# Altium schematic sheet MainPlanSchDoc.SchDoc
size 420 x 297 mm; Date: 1404/07/05; CheckedBy: ?; DrawnBy: MohammadReza Tabasian; Engineer: MohammadReza Tabasian; SheetNumber: 1; SheetTotal: 2; SheetNumberSPQ: 1; SheetTotalSPQ: 2; Project: robotShield; FileName: MainPlanSchDoc.SchDoc
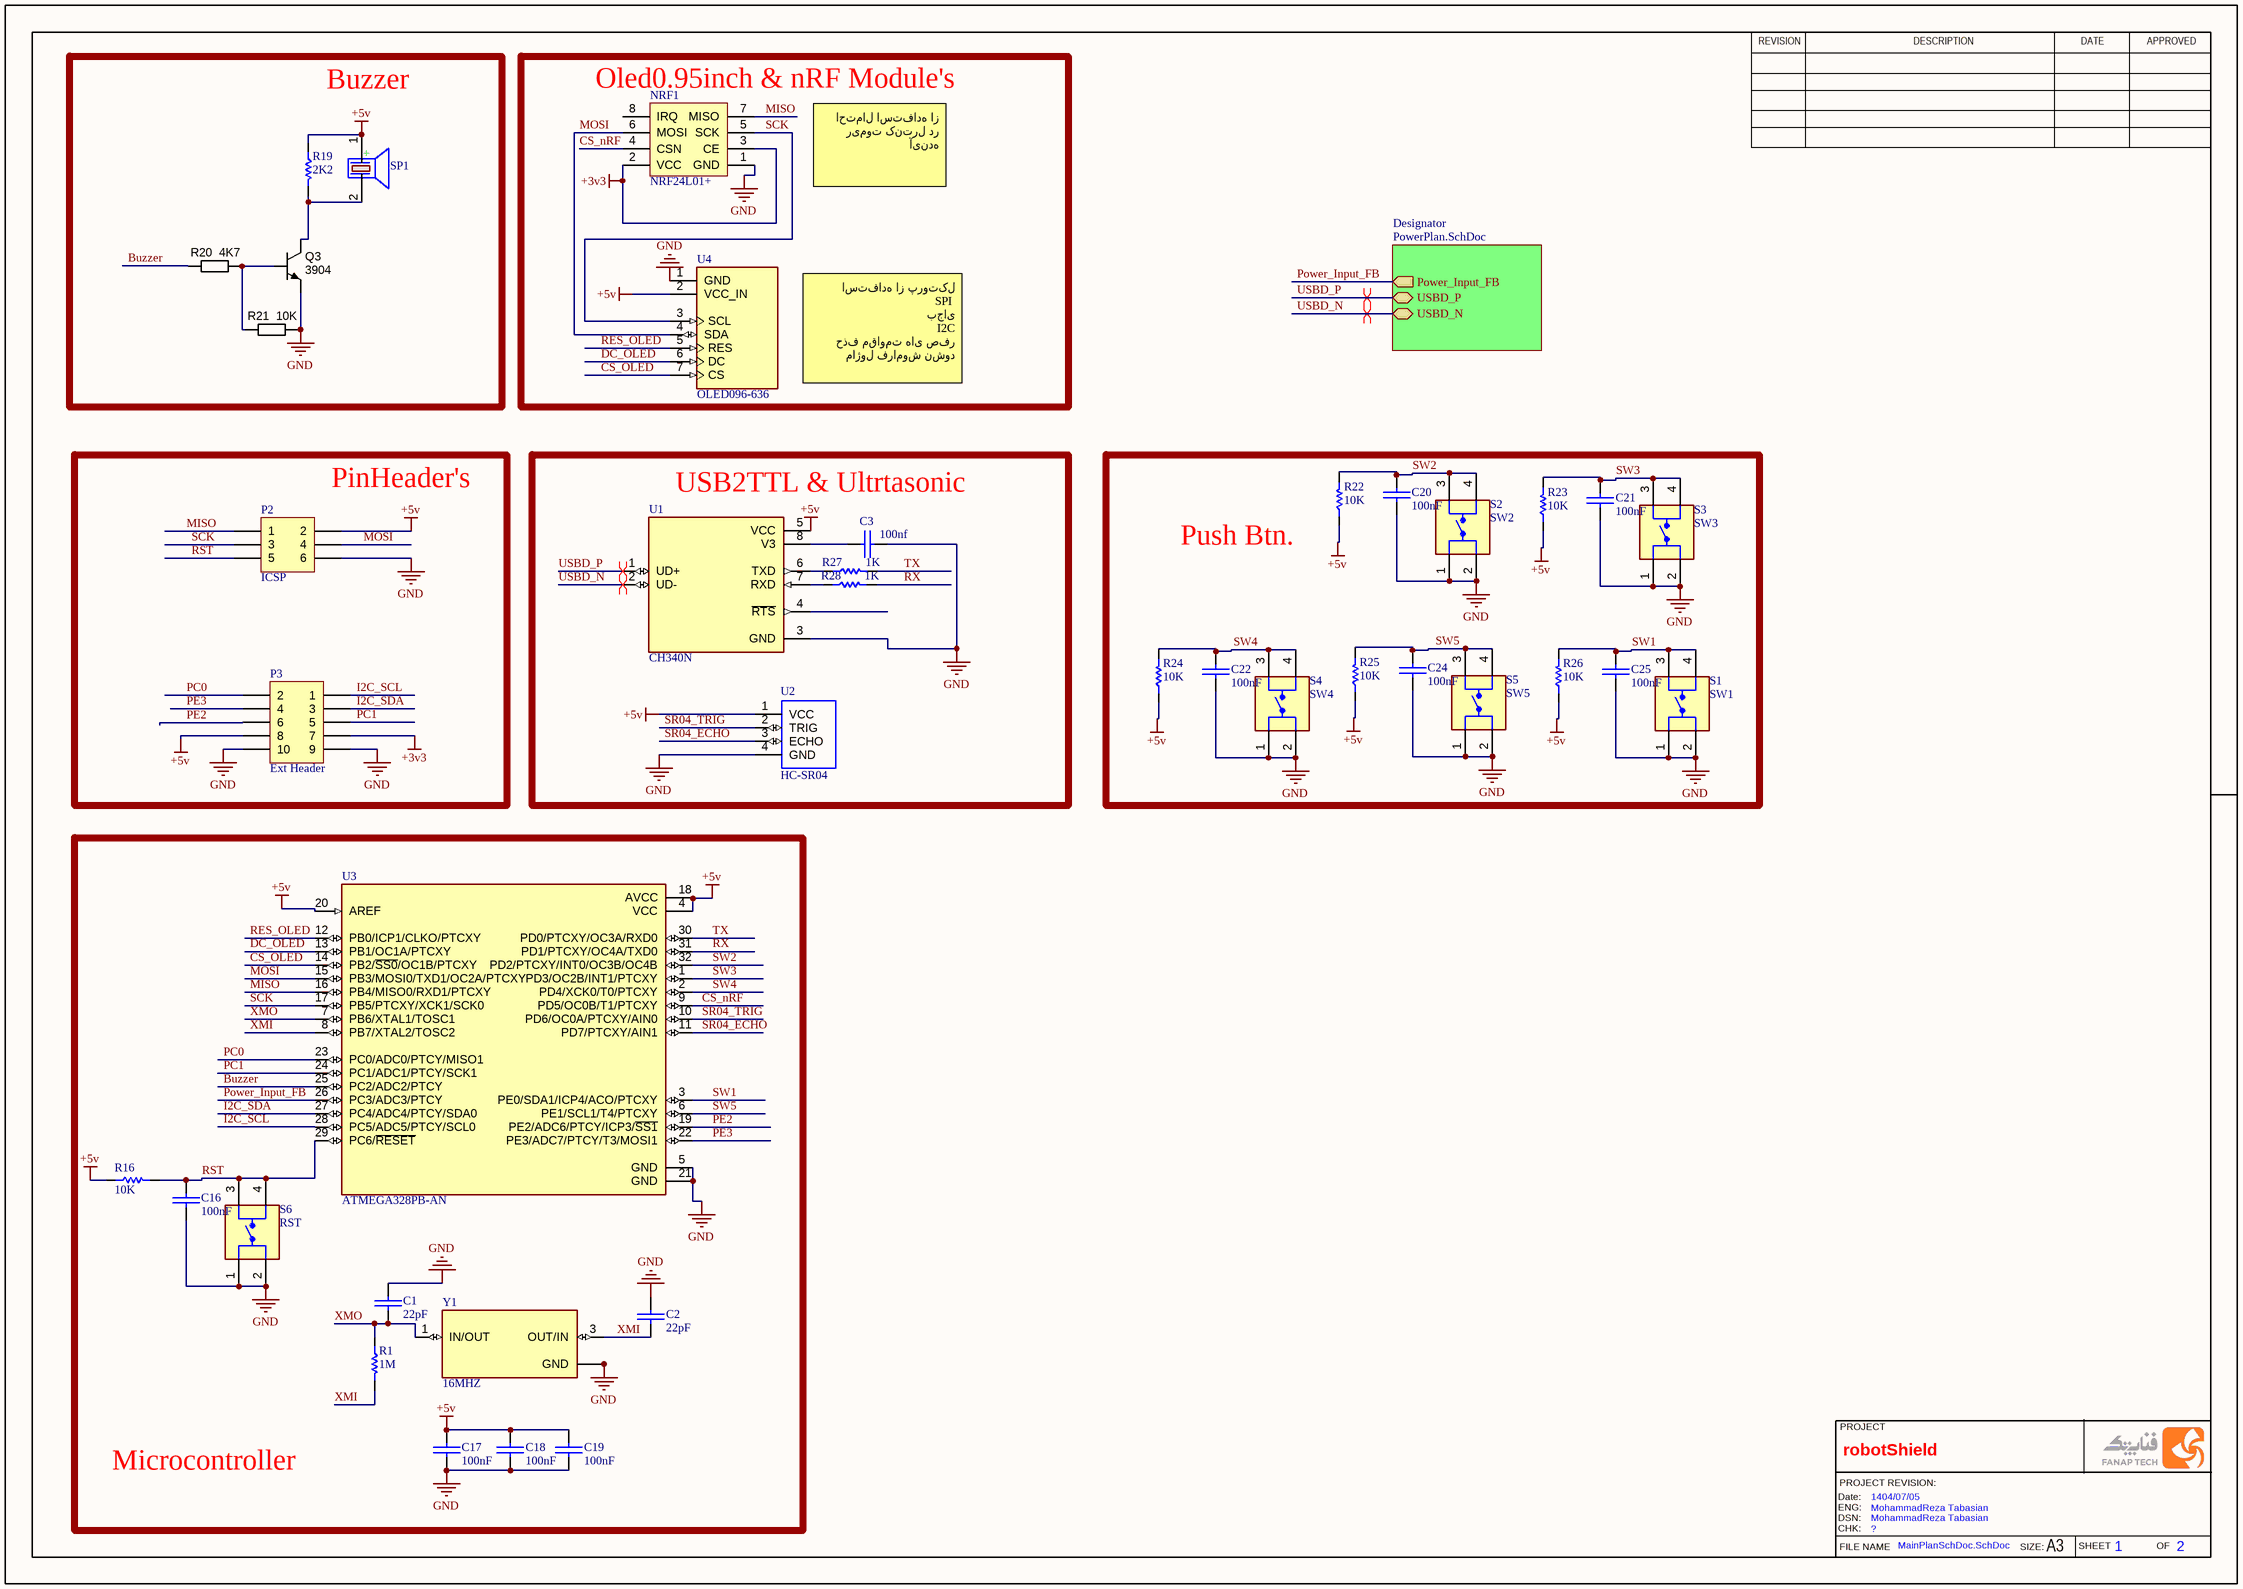
[diagram p0: MainPlanSchDoc.SchDoc]

## Parts
C1  22pF  [C0805]
C2  22pF  [C0805]
C3  100nf  [C0805]
C16  100nF  [C0805]
C17  100nF  [C0805]
C18  100nF  [C0805]
C19  100nF  [C0805]
C20  100nF  [C0805]
C21  100nF  [C0805]
C22  100nF  [C0805]
C24  100nF  [C0805]
C25  100nF  [C0805]
NRF1  NRF24L01+  [NRF24L01P]
P2  ICSP  [HDR2X3]
P3  Ext Header  [HDR2X5]
Q3  3904  [SOT23-3]
R1  1M  [C0805]
R16  10K  [C0805]
R19  2K2  [C0805]
R20  4K7  [C0805]
R21  10K  [C0805]
R22  10K  [C0805]
R23  10K  [C0805]
R24  10K  [C0805]
R25  10K  [C0805]
R26  10K  [C0805]
R27  1K  [C0805]
R28  1K  [C0805]
S1  SW1  [microswitch]
S2  SW2  [microswitch]
S3  SW3  [microswitch]
S4  SW4  [microswitch]
S5  SW5  [microswitch]
S6  RST  [microswitch]
SP1  (no value)  [BUZZER 7.62mm DC]
U1  CH340N  [SOIC_8P_127P600X170-9N]
U2  HC-SR04  [XCVR_HC-SR04]
U3  ATMEGA328PB-AN  [QFP80P900X900X160-32N]
U4  OLED096-636  [OLED096-636]
Y1  16MHZ  [XTAL_3225]

## Blocks framed on the sheet
Buzzer: Q3 R19-R21 SP1
Oled0.95inch & nRF Module's: NRF1 U4
PinHeader's: P2 P3
USB2TTL & Ultrtasonic: C3 R27 R28 U1 U2
Push Btn.: C20-C22 C24 C25 R22-R26 S1-S5
Microcontroller: C1 C2 C16-C19 R1 R16 S6 U3 Y1

## Sub-sheets
Designator = PowerPlan.SchDoc: Power_Input_FB (out), USBD_P (bidir), USBD_N (bidir)

## Nets
+3v3: NRF1.2(VCC) NRF1.3(CE) P3.7
+5v: C17.1(+) C18.1(+) C19.1(+) P2.2 P3.8 R16.1 R19.1 R22.1 R23.1 R24.1 R25.1 R26.1 SP1.1(+) U1.5(VCC) U2.1(VCC) U3.4(VCC) U3.18(AVCC) U3.20(AREF) U4.2(VCC_IN)
GND: C1.1(+) C2.1(+) C3.2(-) C16.2(-) C17.2(-) C18.2(-) C19.2(-) C20.2(-) C21.2(-) C22.2(-) C24.2(-) C25.2(-) NRF1.1(GND) P2.6 P3.9 P3.10 Q3.2(E) R21.2 S1.1 S1.2 S2.1 S2.2 S3.1 S3.2 S4.1 S4.2 S5.1 S5.2 S6.1 S6.2 U1.3(GND) U2.4(GND) U3.5(GND) U3.21(GND) U4.1(GND) Y1.2(GND) Y1.4(GND)
Buzzer: R20.1 U3.25(PC2/ADC2/PTCY)
CS_nRF: NRF1.4(CSN) U3.9(PD5/OC0B/T1/PTCXY)
CS_OLED: U3.14(PB2/~{SS0}/OC1B/PTCXY) U4.7(CS)
DC_OLED: U3.13(PB1/OC1A/PTCXY) U4.6(DC)
I2C_SCL: P3.1 U3.28(PC5/ADC5/PTCY/SCL0)
I2C_SDA: P3.3 U3.27(PC4/ADC4/PTCY/SDA0)
MISO: NRF1.7(MISO) P2.1 U3.16(PB4/MISO0/RXD1/PTCXY)
MOSI: NRF1.6(MOSI) P2.4 U3.15(PB3/MOSI0/TXD1/OC2A/PTCXY) U4.4(SDA)
PC0: P3.2 U3.23(PC0/ADC0/PTCY/MISO1)
PC1: P3.5 U3.24(PC1/ADC1/PTCY/SCK1)
PE2: P3.6 U3.19(PE2/ADC6/PTCY/ICP3/~{SS1})
PE3: P3.4 U3.22(PE3/ADC7/PTCY/T3/MOSI1)
Power_Input_FB: U3.26(PC3/ADC3/PTCY) ; sheet Designator/Power_Input_FB
RES_OLED: U3.12(PB0/ICP1/CLKO/PTCXY) U4.5(RES)
RST: C16.1(+) P2.5 R16.2 S6.3 S6.4 U3.29(PC6/~{RESET})
RX: R28.2 U3.31(PD1/PTCXY/OC4A/TXD0)
SCK: NRF1.5(SCK) P2.3 U3.17(PB5/PTCXY/XCK1/SCK0) U4.3(SCL)
SR04_ECHO: U2.3(ECHO) U3.11(PD7/PTCXY/AIN1)
SR04_TRIG: U2.2(TRIG) U3.10(PD6/OC0A/PTCXY/AIN0)
SW1: C25.1(+) R26.2 S1.3 S1.4 U3.3(PE0/SDA1/ICP4/ACO/PTCXY)
SW2: C20.1(+) R22.2 S2.3 S2.4 U3.32(PD2/PTCXY/INT0/OC3B/OC4B)
SW3: C21.1(+) R23.2 S3.3 S3.4 U3.1(PD3/OC2B/INT1/PTCXY)
SW4: C22.1(+) R24.2 S4.3 S4.4 U3.2(PD4/XCK0/T0/PTCXY)
SW5: C24.1(+) R25.2 S5.3 S5.4 U3.6(PE1/SCL1/T4/PTCXY)
TX: R27.2 U3.30(PD0/PTCXY/OC3A/RXD0)
USBD_N: U1.2(UD-) ; sheet Designator/USBD_N
USBD_P: U1.1(UD+) ; sheet Designator/USBD_P
XMI: C2.2(-) R1.2 U3.8(PB7/XTAL2/TOSC2) Y1.3(OUT/IN)
XMO: C1.2(-) R1.1 U3.7(PB6/XTAL1/TOSC1) Y1.1(IN/OUT)
NetC3_1: C3.1(+) U1.8(V3)
NetQ3_1: Q3.1(B) R20.2 R21.1
NetQ3_3: Q3.3(C) R19.2 SP1.2(-)
NetR27_1: R27.1 U1.6(TXD)
NetR28_1: R28.1 U1.7(RXD)

Not connected (* = marked no-connect by the designer): NRF1 8(IRQ); U1 4(~{RTS})

## Layout directives
differential pair: USBD_N, USBD_P

## Notes on the sheet
- احتمال استفاده از ریموت کنترل در آینده
- استفاده از پروتکل
  SPI
  بجای
  I2C
  حذف مقاومت های صفر ماژول فراموش نشود
- REVISION
- DESCRIPTION
- DATE
- APPROVED
- PROJECT
- FILE NAME
- PROJECT REVISION:
- Date:
- ENG:
- DSN:
- CHK:
- SIZE:
- SHEET
- OF
- A3

## Library data of the parts
C1-C3 C16-C22 C24 C25 = Cap-Bipolar: Bipolar Capacitor; Voltage: 100V; Designer: Saeid Jorablo; Organazation: ControTec; Adding Date: 1387/12/20
NRF1 = NRF24L01P: RF Module; Ali Hafizi: Creature
P2 = Header 3X2: Header, 3-Pin, Dual row; LatestRevisionDate: 17-Jul-2002; LatestRevisionNote: Re-released for DXP Platform.; Publisher: Altium Limited
P3 = Header 5X2: Header, 5-Pin, Dual row; LatestRevisionDate: 17-Jul-2002; LatestRevisionNote: Re-released for DXP Platform.; Publisher: Altium Limited
Q3 = NPN_MMBT3904: Transistor SMD NPN 40V 0.2A 250mW SOT-23; Manufacturer 1: Fairchild Semiconductor; Ratings: 40V; 200mA; 250mW; Material: Si; SCDType: source; Package / Case: SOT-23; Supplier 1: Digi-Key; Supplier Part Number 1: MMBT3904FSCT-ND; Transistor Type: NPN; Mounting Type: Surface Mount; Supplier 2: Digi-Key; Supplier Part Number 2: 568-1741-1-ND; Manufacturer 2: NXP Semiconductors; Manufacturer Part Number 2: PMBT3904,215; ComponentLink2URL: http://www.nxp.com/documents/data_sheet/PMBT3904.pdf; ComponentLink2Description: http://www.nxp.com/documents/data_sheet/PMBT3904.pdf; ComponentLink1URL: http://www.fairchildsemi.com/ds/MM/MMBT3904.pdf; ComponentLink1Description: http://www.fairchildsemi.com/ds/MM/MMBT3904.pdf; Manufacturer Part Number 1: 3904
R1 R16 R19 R22-R28 = Resistor
R20 R21 = RES_0R_0805: Resistor SMD 0805; Manufacturer 1: Samsung Electro-Mechanics America, Inc; Manufacturer Part Number 1: RC2012J000CS; Ratings: 1/8W; SCDType: spec; Tolerance: N/A; Package / Case: 0805 (2012 metric); Supplier 1: Digi-Key; Supplier Part Number 1: 1276-5466-6-ND; RoHS 1: RoHS Compliant; ComponentLink1URL: http://www.samsungsem.com/servlet/FileDownload?filename=productcatalog/pdf/Chip_Resistor.pdf; ComponentLink1Description: http://www.samsungsem.com/servlet/FileDownload?filename=productcatalog/pdf/Chip_Resistor.pdf; Supplier 2: Digi-Key; Supplier Part Number 2: RMCF0805ZT0R00DKR-ND; Manufacturer 2: Stackpole Electronics Inc; Manufacturer Part Number 2: RMCF0805ZT0R00; RoHS 2: RoHS Compliant; ComponentLink2URL: http://www.seielect.com/Catalog/SEI-RMCF_RMCP.pdf; ComponentLink2Description: http://www.seielect.com/Catalog/SEI-RMCF_RMCP.pdf; Supplier 3: Digi-Key; Supplier Part Number 3: 311-0.0ARDKR-ND; Manufacturer 3: Yageo; Manufacturer Part Number 3: RC0805JR-070RL; RoHS 3: RoHS Compliant; ComponentLink3URL: http://media.digikey.com/pdf/Data%20Sheets/Yageo%20PDFs/RC0805%20Pb%20Free.pdf; ComponentLink3Description: http://media.digikey.com/pdf/Data%20Sheets/Yageo%20PDFs/RC0805%20Pb%20Free.pdf; Supplier 4: Digi-Key; Supplier Part Number 4: P0.0ADKR-ND; Manufacturer 4: Panasonic Electronic Components; Manufacturer Part Number 4: ERJ-6GEY0R00V; RoHS 4: RoHS Compliant; ComponentLink4URL: http://industrial.panasonic.com/www-cgi/jvcr13pz.cgi?E+PZ+3+AOA0001+ERJ6GEY0R00V+7+WW; ComponentLink4Description: http://industrial.panasonic.com/www-cgi/jvcr13pz.cgi?E+PZ+3+AOA0001+ERJ6GEY0R00V+7+WW; Supplier 5: Digi-Key; Supplier Part Number 5: RHM0.0CPDKR-ND; Manufacturer 5: Rohm Semiconductor; Manufacturer Part Number 5: MCR10ERTJ000; RoHS 5: RoHS Compliant; ComponentLink5URL: http://rohmfs.rohm.com/en/products/databook/datasheet/passive/resistor/chip_resistor/mcr_g.pdf; ComponentLink5Description: http://rohmfs.rohm.com/en/products/databook/datasheet/passive/resistor/chip_resistor/mcr_g.pdf
S1-S6 = Switch_Push_Button: Tactile Switch SPST-NO Top Actuated Surface Mount; MP: PTS525SM15SMTR2 LFS; MF: C&K; Package: Tactile Switch CK; SnapEDA_Link: https://www.snapeda.com/parts/PTS525SM15SMTR2%20LFS/C%2526K/view-part/?ref=snap; Purchase-URL: https://pricing.snapeda.com/search/part/PTS525SM15SMTR2 LFS/?ref=eda; Check_prices: https://www.snapeda.com/parts/PTS525SM15SMTR2%20LFS/C%2526K/view-part/?ref=eda; Availability: In Stock; Value: *; Price: None
SP1 = PIEZO BUZZER: PIEZO BUZZER ACTIVE; Designer: Abbas Basereh; Comment_1: SPEAKER AND BEEP; Design Date: 1395/11/14; ComponentLink2Description: Reference; PackageDescription: THD; Publisher: Abbas Basereh; Mounting Technology: THD; Pin Count: 2; Status: Unreleased
U1 = CH340N: USB to Serial Port Chip; MF: WCH; SnapEDA_Link: https://www.snapeda.com/parts/CH340N/WCH/view-part/?ref=snap; Package: Package; Value: *; MP: CH340N; Check_prices: https://www.snapeda.com/parts/CH340N/WCH/view-part/?ref=eda
U2 = HC-SR04: Ultrasonic Sensor Module; Availability: Unavailable; MP: HC-SR04; Value: *; Price: None; Package: None
U3 = ATMEGA328PB-AN: AVR AVRÂ® ATmega, Functional Safety (FuSa) Microcontroller IC 8-Bit 20MHz 32KB (16K x 16) FLASH 32-TQFP (7x7); MF: Microchip Technology; MP: ATMEGA328PBAN; SnapEDA_Link: https://www.snapeda.com/parts/ATMEGA328PBAN/Microchip+Technology/view-part/?ref=snap; Package: None; Value: *; Check_prices: https://www.snapeda.com/parts/ATMEGA328PBAN/Microchip+Technology/view-part/?ref=eda
U4 = OLED096-636: 0.96 128 X 64 MONOCHROME GRAPHIC OLED DISPLAY MODULE - SPI- I2C; MP: DM-OLED096-636; SnapEDA_Link: https://www.snapeda.com/parts/DM-OLED096-636/Display+Module/view-part/?ref=snap; Package: Package; Value: *; MF: Display Module; Check_prices: https://www.snapeda.com/parts/DM-OLED096-636/Display+Module/view-part/?ref=eda
Y1 = Crystal 3225: Crystals 25.0000MHZ 6PF SMD ECX-33B2 +/-2 ppm Aging 3225 4-SMD RoHS; MF: ECS; MP: ECS-250-6-33B2-CTN-TR3; SnapEDA_Link: https://www.snapeda.com/parts/ECS-250-6-33B2-CTN-TR3/ECS/view-part/?ref=snap; Package: ECS-33B2-33B2-4 ECS; Value: *; Check_prices: https://www.snapeda.com/parts/ECS-250-6-33B2-CTN-TR3/ECS/view-part/?ref=eda